# Altium project Irradiance Sensor.PrjPcb
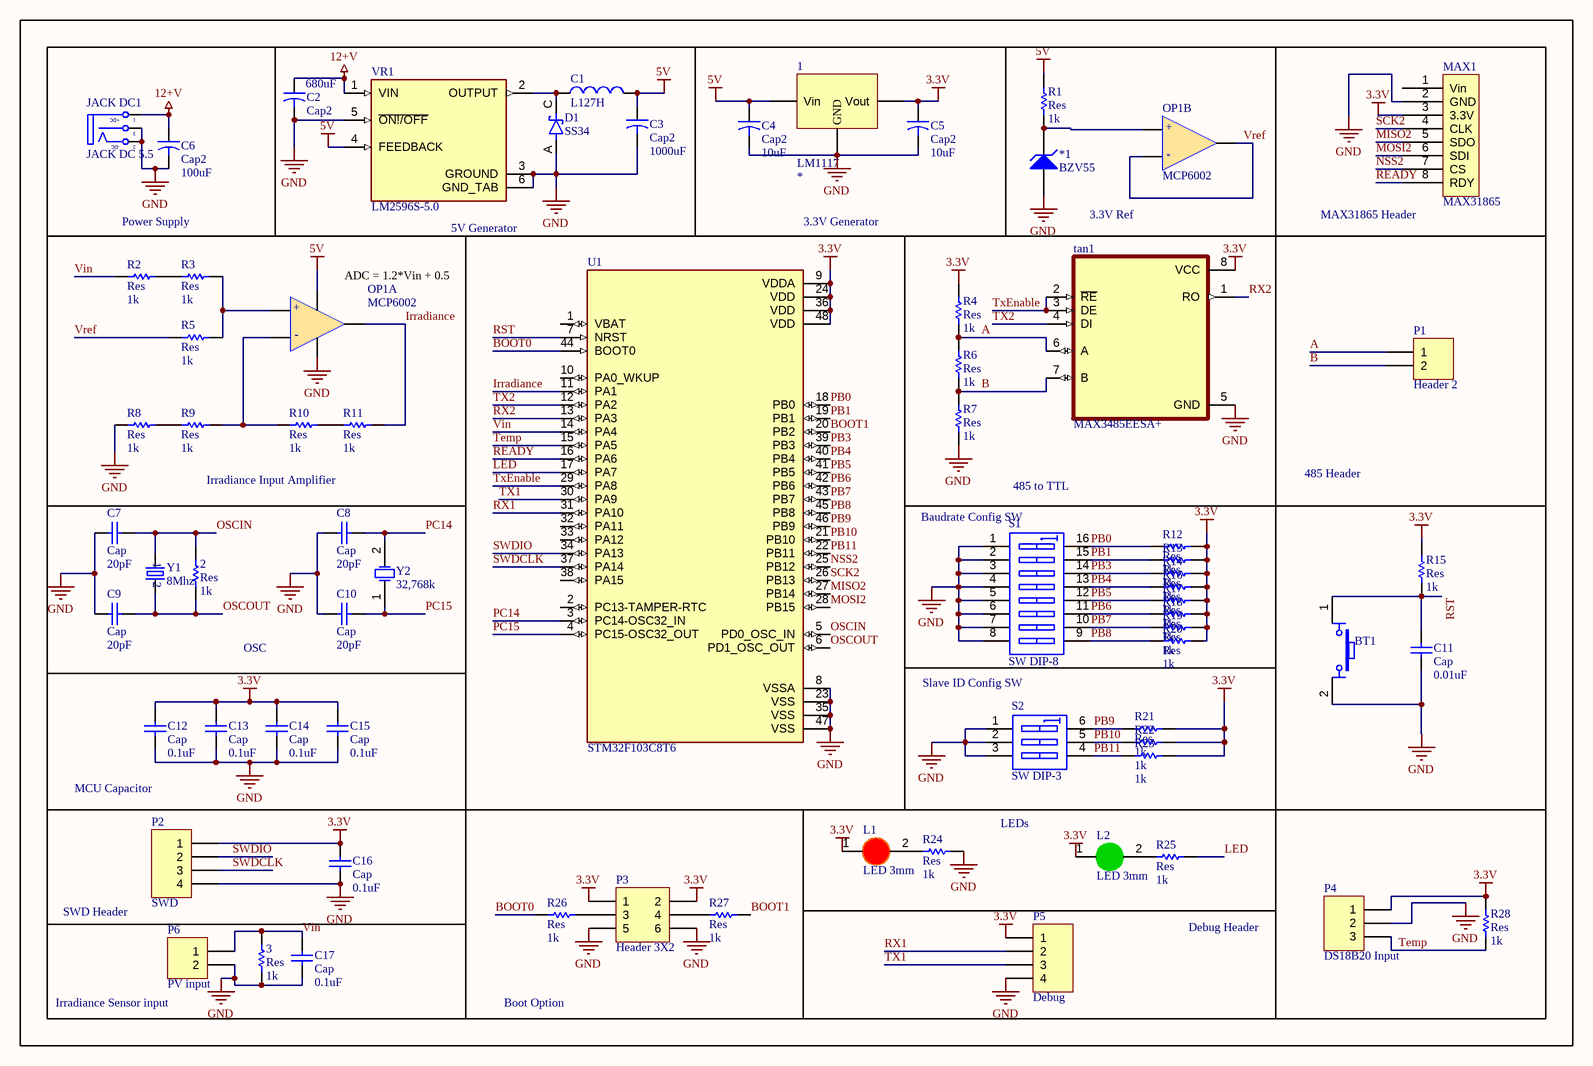
[diagram p0: Irradiance Sensor.SchDoc]
1 sheet, 69 parts. Net scope: global (net labels, ports and power ports of the same name join across sheets).
Board file: Irradiance Sensor2.PcbDoc

## Sheet Irradiance Sensor.SchDoc
size A4; SheetNumber: 1; SheetTotal: 1; SPICEModelCacheCUJCCLGD: <root> / <DocumentId>CUJCCLGD</DocumentId> / <CacheFrame Number="0"> / <Model Name="cap" Kind="MDL"> / <Text>*Default semiconductor capacitor / .MODEL CAP C()</Text> / </Model> / <Model Name="xtal" Kind="CKT"> / <Text>*Generic type:crystal pkg:HC33/51 / .SUBCKT XTAL 1 2 PARAMS: FREQ=1Meg RS=750 C=13pf Q=1000 / LX 1 3 {((Q*RS)/(6.2831852*FREQ))} IC=0.5M / CX 3 4 {(1/(Q*6.2831852*FREQ*RS))} / C0 1 2 {C} / RS 4 2 {RS} / .ENDS XTAL</Text> / </Model> / <Model Name="dpsw8" Kind="CKT"> / <Text>* DIP switch 8 / * jjt 20/6/2002: created / * / *             Switch connections: / *             sw1 / *             |  |  sw2 / *             |  |  |  |  sw3 / *             |  |  |  |  |  |   sw4 / *             |  |  |  |  |  |  |   |    sw5 / *             |  |  |  |  |  |  |   |   |   |    sw6 / *             |  |  |  |  |  |  |   |   |   |   |   |    sw7 / *             |  |  |  |  |  |  |   |   |   |   |   |   |   |    sw8 / *             |  |  |  |  |  |  |   |   |   |   |   |   |   |   |   | / *             |  |  |  |  |  |  |   |   |   |   |   |   |   |   |   | / .subckt dpsw8 1  2  4  5  7  8  10  11  13  14  16  17  19  20  22  23 / + PARAMS: STATE1=0 STATE2=0 STATE3=0 STATE4=0 STATE5=0 STATE6=0 STATE7=0 STATE8=0 RON=1m ROFF=100E6 / * / V1 3  0 {STATE1} / V2 6  0 {STATE2} / V3 9  0 {STATE3} / V4 12 0 {STATE4} / V5 15 0 {STATE5} / V6 18 0 {STATE6} / V7 21 0 {STATE7} / V8 24 0 {STATE8} / * / SDIP1 1  2  3  0 DIPMOD / SDIP2 4  5  6  0 DIPMOD / SDIP3 7  8  9  0 DIPMOD / SDIP4 10 11 12 0 DIPMOD / SDIP5 13 14 15 0 DIPMOD / SDIP6 16 17 18 0 DIPMOD / SDIP7 19 20 21 0 DIPMOD / SDIP8 22 23 24 0 DIPMOD / * / .MODEL DIPMOD SW(VT=0.5 RON={RON} ROFF={ROFF}) / .ends dpsw8</Text> / </Model> / <Model Name="dpsw3" Kind="CKT"> / <Text>* DIP switch 3 / * jjt 20/6/2002: created / * / *             Switch connections: / *             sw1 / *             |  |  sw2 / *             |  |  |  |  sw3 / *             |  |  |  |  |  | / *             |  |  |  |  |  | / .subckt dpsw3 1  2  4  5  7  8 / + PARAMS: STATE1=0 STATE2=0 STATE3=0 RON=1m ROFF=100E6 / * / V1 3 0 {STATE1} / V2 6 0 {STATE2} / V3 9 0 {STATE3} / * / SDIP1 1 2 3 0 DIPMOD / SDIP2 4 5 6 0 DIPMOD / SDIP3 7 8 9 0 DIPMOD / * / .MODEL DIPMOD SW(VT=0.5 RON={RON} ROFF={ROFF}) / .ends dpsw3</Text> / </Model> / </CacheFrame> / </root>

### Parts
1  LM1117  [SOT230P700X180-4N]
2  Res  value 1k  [RESC2012X11N]
3  Res  value 1k  [RESC2012X11N]
*1  BZV55  [SOD-80C]
BT1  Nut Nhan 4 Chan Cam 6x6  [Nut Nhan 4 Chan Cam 6x6]  (value not drawn)
C1  L127H  [INDP122122X80N]
C2  Cap2  value 680uF  [CAPR5-4X5]
C3  Cap2  value 1000uF  [CAPR5-4X5]
C4  Cap2  value 10uF  [CAPR5-4X5]
C5  Cap2  value 10uF  [CAPR5-4X5]
C6  Cap2  value 100uF  [CAPR5-4X5]
C7  Cap  Cap: 20pF  [RESC2012X11N]
C8  Cap  Cap: 20pF  [RESC2012X11N]
C9  Cap  Cap: 20pF  [RESC2012X11N]
C10  Cap  Cap: 20pF  [RESC2012X11N]
C11  Cap  Cap: 0.01uF  [RESC2012X11N]
C12  Cap  Cap: 0.1uF  [RESC2012X11N]
C13  Cap  Cap: 0.1uF  [RESC2012X11N]
C14  Cap  Cap: 0.1uF  [RESC2012X11N]
C15  Cap  Cap: 0.1uF  [RESC2012X11N]
C16  Cap  Cap: 0.1uF  [RESC2012X11N]
C17  Cap  Cap: 0.1uF  [RESC2012X11N]
D1  SS34  [DIOM7959X265N]
JACK_DC1  JACK DC 5.5  [JACK DC 5.5]
L1  LED 3mm  [LED-3MM-RED]
L2  LED 3mm  [LED-3MM-GREEN]
MAX1  MAX31865  [MAX31865]
OP1  MCP6002  [DIP8]  (parts A,B of 2)
P1  Header 2  [TE_282837-2]
P2  SWD  [HDR1X4]
P3  Header 3X2  [HDR2X3]
P4  DS18B20 Input  [HDR1X3]
P5  Debug  [HDR1X4]
P6  PV input  [HDR1X2]
R1  Res  value 1k  [RESC2012X11N]
R2  Res  value 1k  [RESC2012X11N]
R3  Res  value 1k  [RESC2012X11N]
R4  Res  value 1k  [RESC2012X11N]
R5  Res  value 1k  [RESC2012X11N]
R6  Res  value 1k  [RESC2012X11N]
R7  Res  value 1k  [RESC2012X11N]
R8  Res  value 1k  [RESC2012X11N]
R9  Res  value 1k  [RESC2012X11N]
R10  Res  value 1k  [RESC2012X11N]
R11  Res  value 1k  [RESC2012X11N]
R12  Res  value 1k  [RESC2012X11N]
R13  Res  value 1k  [RESC2012X11N]
R14  Res  value 1k  [RESC2012X11N]
R15  Res  value 1k  [RESC2012X11N]
R16  Res  value 1k  [RESC2012X11N]
R17  Res  value 1k  [RESC2012X11N]
R18  Res  value 1k  [RESC2012X11N]
R19  Res  value 1k  [RESC2012X11N]
R20  Res  value 1k  [RESC2012X11N]
R21  Res  value 1k  [RESC2012X11N]
R22  value 1k  [RESC2012X11N]
R23  value 1k  [RESC2012X11N]
R24  Res  value 1k  [RESC2012X11N]
R25  Res  value 1k  [RESC2012X11N]
R26  Res  value 1k  [RESC2012X11N]
R27  Res  value 1k  [RESC2012X11N]
R28  Res  value 1k  [RESC2012X11N]
S1  SW DIP-8  [DIP16]
S2  SW DIP-3  [DIP-6]
tan1  MAX3485EESA+  [SOIC127P600X175-8N]
U1  STM32F103C8T6  [QFP50P900X900X160-48N]
VR1  LM2596S-5.0  [TO170P1524X483-6N]
Y1  8Mhz  [HC49US]
Y2  32,768k  [R38]

### Blocks framed on the sheet
Debug Header: P5

### Nets
3.3V: 1.2(Vout) C5.1 C12.1 C13.1 C14.1 C15.1 C16.1 L1.1(A) L2.1(A) MAX1.3(3.3V) P2.1 P3.1 P3.2 P4.1 P5.1 R4.2 R12.1 R13.1 R14.1 R15.2 R16.1 R17.1 R18.1 R19.1 R20.1 R21.1 R22.1 R23.1 R28.2 tan1.8(VCC) U1.9(VDDA) U1.24(VDD) U1.36(VDD) U1.48(VDD)
5V: 1.3(Vin) C1.2 C3.1 C4.1 OP1.8(Vdd) R1.2 VR1.4(FEEDBACK)
12+V: C2.1 C6.1 JACK_DC1.1(T) VR1.1(VIN)
GND: 1.1(GND) 3.1 *1.2(A) BT1.2 C2.2 C3.2 C4.2 C5.2 C6.2 C7.1 C8.1 C9.1 C10.1 C11.2 C12.2 C13.2 C14.2 C15.2 C16.2 C17.2 D1.A JACK_DC1.2(TN) JACK_DC1.3(S) MAX1.2(GND) OP1.4(Vss) P2.4 P3.5 P3.6 P4.2 P5.4 P6.2 R7.1 R8.1 R24.1 S1.1(A1) S1.2(A2) S1.3(A3) S1.4(A4) S1.5(A5) S1.6(A6) S1.7(A7) S1.8(A8) S2.1(A1) S2.2(A2) S2.3(A3) tan1.5(GND) U1.8(VSSA) U1.23(VSS) U1.35(VSS) U1.47(VSS) VR1.3(GROUND) VR1.5(~{ON!/OFF}) VR1.6(GND_TAB)
A: P1.1 R4.1 R6.2 tan1.6(A)
B: P1.2 R6.1 R7.2 tan1.7(B)
BOOT0: R26.2 U1.44(BOOT0)
BOOT1: R27.1 U1.20(PB2)
Irradiance: OP1.1(VoutA) R11.2 U1.11(PA1)
LED: R25.1 U1.17(PA7)
MISO2: MAX1.5(SDO) U1.27(PB14)
MOSI2: MAX1.6(SDI) U1.28(PB15)
NSS2: MAX1.7(CS) U1.25(PB12)
OSCIN: 2.2 C7.2 U1.5(PD0_OSC_IN) Y1.1
OSCOUT: 2.1 C9.2 U1.6(PD1_OSC_OUT) Y1.2
PB0: R12.2 S1.16(B1) U1.18(PB0)
PB1: R13.2 S1.15(B2) U1.19(PB1)
PB3: R14.2 S1.14(B3) U1.39(PB3)
PB4: R16.2 S1.13(B4) U1.40(PB4)
PB5: R17.2 S1.12(B5) U1.41(PB5)
PB6: R18.2 S1.11(B6) U1.42(PB6)
PB7: R19.2 S1.10(B7) U1.43(PB7)
PB8: R20.2 S1.9(B8) U1.45(PB8)
PB9: R21.2 S2.6(B1) U1.46(PB9)
PB10: R22.2 S2.5(B2) U1.21(PB10)
PB11: R23.2 S2.4(B3) U1.22(PB11)
PC14: C8.2 U1.3(PC14-OSC32_IN) Y2.2(OSC2)
PC15: C10.2 U1.4(PC15-OSC32_OUT) Y2.1(OSC1)
READY: MAX1.8(RDY) U1.16(PA6)
RST: BT1.1 C11.1 R15.1 U1.7(NRST)
RX1: P5.2 U1.31(PA10)
RX2: tan1.1(RO) U1.13(PA3)
SCK2: MAX1.4(CLK) U1.26(PB13)
SWDCLK: P2.3 U1.37(PA14)
SWDIO: P2.2 U1.34(PA13)
Temp: P4.3 R28.1 U1.15(PA5)
TX1: P5.3 U1.30(PA9)
TX2: tan1.4(DI) U1.12(PA2)
TxEnable: tan1.2(~{RE}) tan1.3(DE) U1.29(PA8)
Vin: 3.2 C17.1 P6.1 R2.1 U1.14(PA4)
Vref: OP1.6(Vinb-) OP1.7(VoutB) R5.1
Net*1_1: *1.1(K) OP1.5(Vinb+) R1.1
NetC1_1: C1.1 D1.C(K) VR1.2(OUTPUT)
NetL1_2: L1.2(K) R24.2
NetL2_2: L2.2(K) R25.2
NetOP1_2: OP1.2(Vina-) R9.2 R10.1
NetOP1_3: OP1.3(Vina+) R3.2 R5.2
NetP3_3: P3.3 R26.1
NetP3_4: P3.4 R27.2
NetR2_2: R2.2 R3.1
NetR8_2: R8.2 R9.1
NetR10_2: R10.2 R11.1

Not connected (* = marked no-connect by the designer): MAX1 1(Vin); U1 1(VBAT) 2(PC13-TAMPER-RTC) 10(PA0_WKUP) 32(PA11) 33(PA12) 38(PA15)

### Notes on the sheet
- Power Supply
- (near VR1) 5V Generator
- 3.3V Generator
- 3.3V Ref
- (near MAX1) MAX31865 Header
- (near OP1) ADC = 1.2*Vin + 0.5
- Irradiance Input Amplifier
- (near S1) Baudrate Config SW
- 485 to TTL
- 485 Header
- OSC
- Slave ID Config SW
- MCU Capacitor
- LEDs
- SWD Header
- (near P6) Irradiance Sensor input
- Boot Option
- (in symbol JACK DC 5.5) +DC; -DC
- (in symbol MCP6002, part A) +; -
- (in symbol MCP6002, part B) +; -

### Library data of the parts
BT1 = Nut Nhan 4 Chan Cam 6x6: Nut Nhan 4 Chan 6x6mm; Ten: Nút Nhấn 4 Chân 6x6x5MM DIP; Ma_Hang: MH004584
C2-C6 = Cap2: Capacitor; Published: 23-Sep-2002; PackageReference: CAPR5-4X5; Publisher: Altium Limited; PackageDescription: Capacitor; 2 Leads
D1 = SS34: Diode Schottky 40V 3A Surface Mount SMC _DO-214AB_; MF: ON Semiconductor; SnapEDA_Link: https://www.snapeda.com/parts/SS34/ON%20Semiconductor/view-part/4631325/?ref=snap; MP: SS34; Availability: Unavailable; Price: None; Value: *; Package: DO-214AB-214 ON Semiconductor
JACK_DC1 = JACK DC 5.5: Value: Jac DC
L1 = LED 3mm Do: Cắm; Don_Vi: Con; Ma_Hang: MH003892; Ten_Linh_Kien: Led 3MM Phủ Đỏ (10c); Ghi_Chu: *; Kieu_Chan: *; Chung_Loai: Cắm
L2 = LED 3mm Xanh La: Cắm; Don_Vi: Con; Ma_Hang: MH001054; Ten_Linh_Kien: Led 3MM Phủ Xanh (10c); Ghi_Chu: *; Kieu_Chan: *; Chung_Loai: Cắm
P1 P6 = Header 2: Header, 2-Pin; LatestRevisionDate: 17-Jul-2002; LatestRevisionNote: Re-released for DXP Platform.; Publisher: Altium Limited
P2 P5 = Header 4: Header, 4-Pin; LatestRevisionDate: 17-Jul-2002; LatestRevisionNote: Re-released for DXP Platform.; Publisher: Altium Limited
P3 = Header 3X2: Header, 3-Pin, Dual row; LatestRevisionDate: 17-Jul-2002; LatestRevisionNote: Re-released for DXP Platform.; Publisher: Altium Limited
P4 = Header 3: Header, 3-Pin; LatestRevisionDate: 17-Jul-2002; LatestRevisionNote: Re-released for DXP Platform.; Publisher: Altium Limited
R22 R23 = Res
S1 = SW DIP-8: DIP Switch, 8 Position, SPST; Published: 24-Mar-1999; LatestRevisionDate: 17-Jul-2002; LatestRevisionNote: Re-released for DXP Platform.; PackageReference: DIP_SW_8WAY_SMD; Publisher: Altium Limited; PackageDescription: DIP Switch; 16 Leads
S2 = SW DIP-3: DIP Switch, 3 Position, SPST; Published: 24-Mar-1999; LatestRevisionDate: 17-Jul-2002; LatestRevisionNote: Re-released for DXP Platform.; PackageReference: DIP-6; Publisher: Altium Limited; Code_JEDEC: MO-001-AM
tan1 = MAX3485EESA+: 1/1 Transceiver Half RS422, RS485 8-SOIC; MF: Maxim Integrated; SnapEDA_Link: https://www.snapeda.com/parts/MAX3485EESA%2B/Maxim%20Integrated/view-part/558005/?ref=snap; Package: SOIC-8 Maxim; Price: None; MP: MAX3485EESA+; Availability: Unavailable; Value: *
U1 = STM32F103C8T6: ARMÂ® CortexÂ®-M3 STM32F1 Microcontroller IC 32-Bit 72MHz 64KB _64K x 8_ FLASH; MF: STMicroelectronics; Price: None; Package: LQFP-48 STMicroelectronics; Value: *; MP: STM32F103C8T6; Availability: Unavailable; SnapEDA_Link: https://www.snapeda.com/parts/STM32F103C8T6/STMicroelectronics/view-part/52195/?ref=snap
VR1 = LM2596S-5.0: SIMPLE SWITCHER&reg; 4.5V to 40V, 3A Low Component Count Step-Down Regulator 5-DDPAK/TO-263; MF: Texas Instruments; MP: LM2596S-5.0/NOPB; DigiKey-Purchase-URL: https://snapeda.com/shop?store=DigiKey&id=15588; Mouser-Purchase-URL: https://snapeda.com/shop?store=Mouser&id=15588; SnapEDA_Link: https://www.snapeda.com/parts/LM2596S-5.0/NOPB/Texas%20Instruments/view-part/15588/?ref=snap; Price: None; Value: *; Availability: Good; Texas_Instruments-Purchase-URL: https://snapeda.com/shop?store=Texas+Instruments&id=15588; Package: TO-263-5 Texas Instruments
Y1 = DIP-CRYSTAL-8MHZ-20PF-20PPM-60R(HC49US): DIP Crystal 8MHz-20pF-20ppm-60R;; MF: Xinhunjing; MP: 49S8M; Price: None; Package: None; SnapEDA_Link: https://www.snapeda.com/parts/49S8M/Xinhunjing/view-part/105661/?ref=snap; Value: *; Availability: Unavailable
Y2 = XTAL: Crystal Oscillator; Published: 8-Jun-2000; LatestRevisionDate: 17-Jul-2002; LatestRevisionNote: Re-released for DXP Platform.; PackageReference: R38; Publisher: Altium Limited; PackageDescription: Crystal, Thru-Hole; 2 Leads; Body 3.1 x 8.2 mm (Dia.xH)
1 = LM1117: Voltage: *